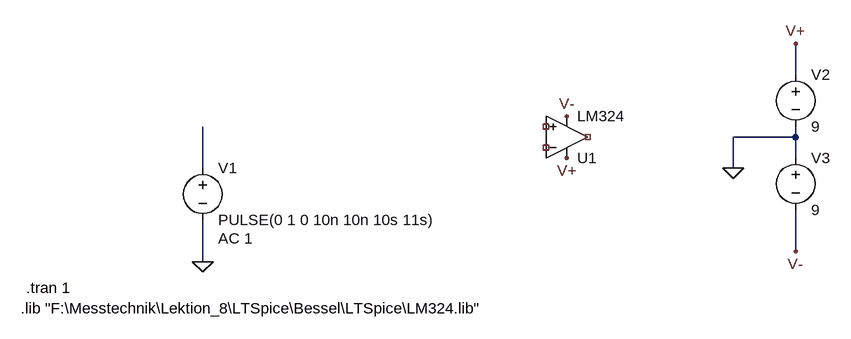
[diagram p0: schematic Umgebung.asc]
Umgebung.asc, the LTspice schematic file:
Version 4
SHEET 1 880 680
WIRE 192 -80 192 -128
WIRE 192 16 192 0
WIRE 192 16 96 16
WIRE 192 48 192 16
WIRE -720 64 -720 0
WIRE 96 64 96 16
WIRE 192 192 192 128
WIRE -720 208 -720 144
FLAG -160 48 V+
FLAG 192 -128 V+
FLAG 192 192 V-
FLAG 96 64 0
FLAG -160 -16 V-
FLAG -720 208 0
SYMBOL voltage 192 -96 R0
WINDOW 123 0 0 Left 2
WINDOW 39 0 0 Left 2
SYMATTR InstName V2
SYMATTR Value 9
SYMBOL voltage 192 32 R0
WINDOW 123 0 0 Left 2
WINDOW 39 0 0 Left 2
SYMATTR InstName V3
SYMATTR Value 9
SYMBOL Opamps\\opamp2 -160 80 M180
SYMATTR InstName U1
SYMATTR Value LM324
SYMATTR SpiceModel LM324
SYMBOL voltage -720 48 R0
WINDOW 123 24 124 Left 2
WINDOW 39 0 0 Left 2
SYMATTR Value2 AC 1
SYMATTR InstName V1
SYMATTR Value PULSE(0 1 0 10n 10n 10s 11s)
TEXT -1000 280 Left 2 !.lib "F:\\Messtechnik\\Lektion_8\\LTSpice\\Bessel\\LTSpice\\LM324.lib"
TEXT -992 248 Left 2 !.tran 1

The netlist it stands for:
* Umgebung.asc
V2 V+ 0 9
V3 0 V- 9
XU1 NC_01 NC_02 V+ V- NC_03 LM324 LM324  ; pins In+ In- V+ V- OUT
V1 N001 0 PULSE(0 1 0 10n 10n 10s 11s) AC 1
.lib "F:\Messtechnik\Lektion_8\LTSpice\Bessel\LTSpice\LM324.lib"
.tran 1
.backanno
.end